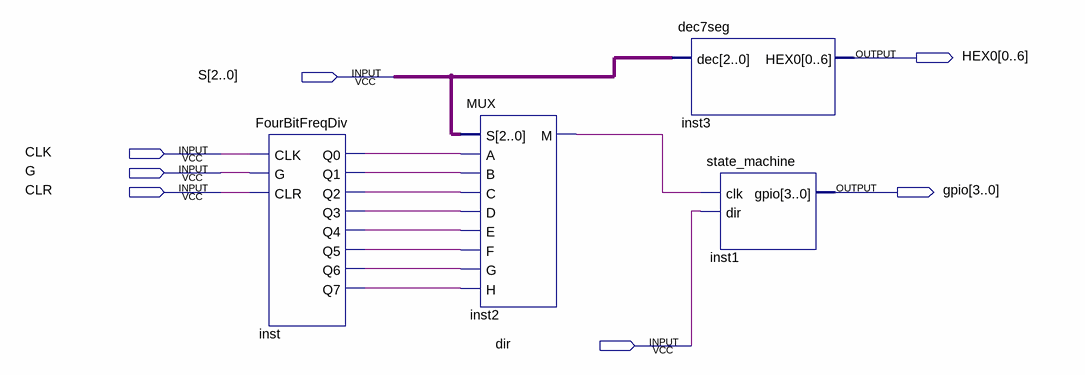
[diagram p0: schematic sheet]
// Quartus schematic KhanJohnFinal.bdf as structural Verilog: 4 symbols, 7 pins
module KhanJohnFinal (
  input  [2:0] S,
  input  CLK,
  input  G,
  input  CLR,
  input  dir,
  output [0:6] HEX0,
  output [3:0] gpio
);

  wire inst2_m, inst_q0, inst_q1, inst_q2, inst_q3, inst_q4, inst_q5, inst_q6, inst_q7;

  FourBitFreqDiv inst (
    .CLK(CLK), .G(G), .CLR(CLR), .Q0(inst_q0), .Q1(inst_q1), .Q2(inst_q2), .Q3(inst_q3), .Q4(inst_q4),
    .Q5(inst_q5), .Q6(inst_q6), .Q7(inst_q7));
  MUX inst2 (
    .S(S), .A(inst_q0), .B(inst_q1), .C(inst_q2), .D(inst_q3), .E(inst_q4), .F(inst_q5), .G(inst_q6),
    .H(inst_q7), .M(inst2_m));
  dec7seg inst3 (.dec(S), .HEX0(HEX0));
  state_machine inst1 (.clk(inst2_m), .dir(dir), .gpio(gpio));
endmodule
